# Altium project f1_hw_1.PrjPCB
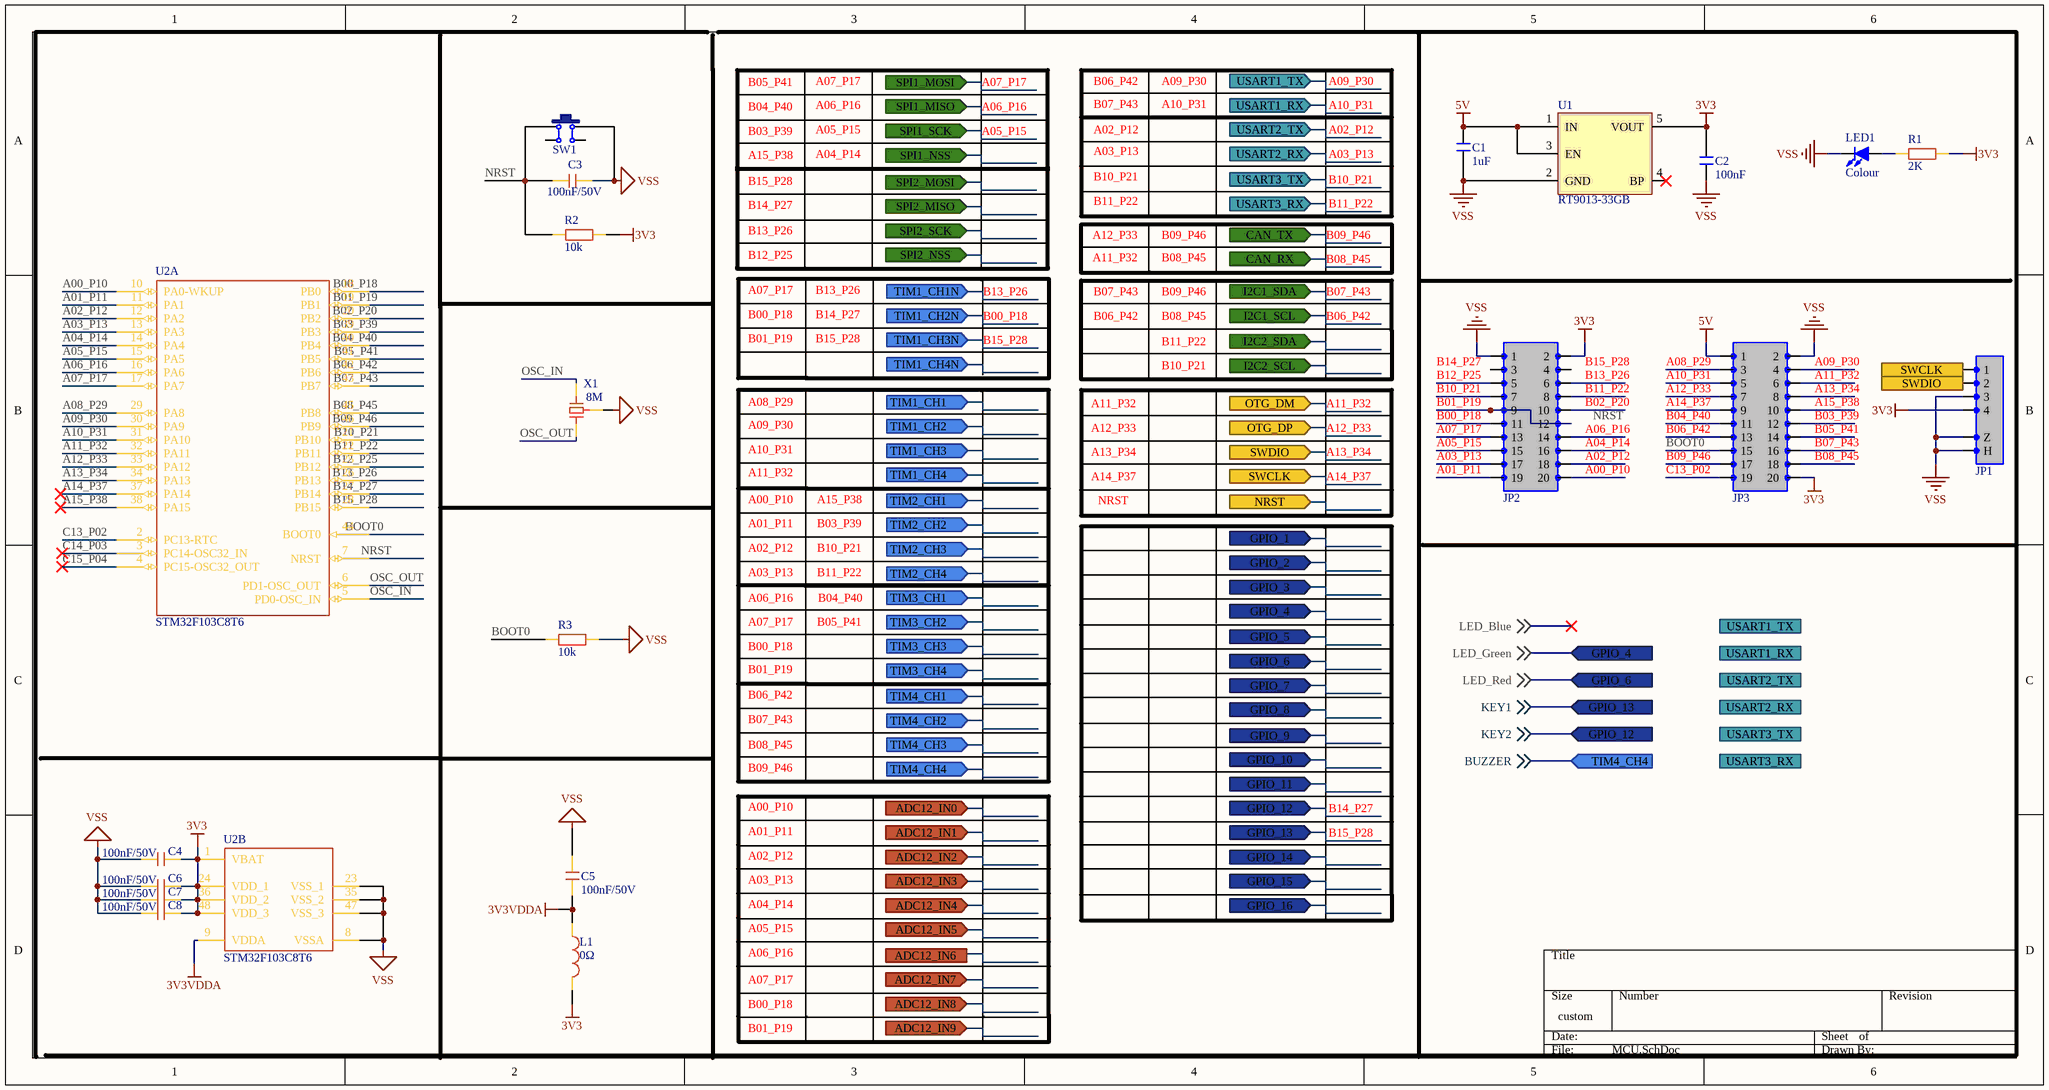
[diagram p0: MCU.SchDoc]
2 sheets, 29 parts. Net scope: flat (ports and power ports of the same name join across sheets).
Board file: f1_hw_1_V00.04.PcbDoc
Sheets:
  MCU.SchDoc
  FUC.SchDoc

## Sheet MCU.SchDoc
size 383 x 203 mm

### Parts
C1  1uF  [C 0603_L]
C2  100nF  [C 0603_L]
C3  100nF/50V  [C 0603_L]
C4  100nF/50V  [C 0603_L]
C5  100nF/50V  [C 0603_L]
C6  100nF/50V  [C 0603_L]
C7  100nF/50V  [C 0603_L]
C8  100nF/50V  [C 0603_L]
JP1  HDR-1X4  [GH 1.25-WS-4P]  (value not drawn)
JP2  Header 2X10  [HDR2.54-LI-2x10P]  (value not drawn)
JP3  Header 2X10  [HDR2.54-LI-2x10P]  (value not drawn)
L1  0Ω  [L 0603]
LED1  Colour  [LED 0603R]
R1  2K  [R 0603_L]
R2  10k  [R 0603_L]
R3  10k  [R 0603_L]
SW1  3.2x4.2x2.5  [TSW SMD-3*4*2]  (value not drawn)
U1  RT9013-33GB  [SOT23-5]
U2  STM32F103C8T6  [LQFP48 7X7_L]  (parts A,B of 2)
X1  8M  [OSC 3213-3P]

### Ports
ADC12_IN0 (in), ADC12_IN1 (in), ADC12_IN2 (in), ADC12_IN3 (in), ADC12_IN4 (in), ADC12_IN5 (in), ADC12_IN6 (in), ADC12_IN7 (in), ADC12_IN8 (in), ADC12_IN9 (in), CAN_RX (in), CAN_TX (in), GPIO_1 (in), GPIO_2 (in), GPIO_3 (in), GPIO_4 (in), GPIO_5 (in), GPIO_6 (in), GPIO_7 (in), GPIO_8 (in), GPIO_9 (in), GPIO_10 (in), GPIO_11 (in), GPIO_12 (in), GPIO_13 (in), GPIO_14 (in), GPIO_15 (in), GPIO_16 (in), I2C1_SCL (in), I2C1_SDA (in), I2C2_SCL (in), I2C2_SDA (in), NRST (in), OTG_DM (in), OTG_DP (in), SPI1_MISO (in), SPI1_MOSI (in), SPI1_NSS (in), SPI1_SCK (in), SPI2_MISO (in), SPI2_MOSI (in), SPI2_NSS (in), SPI2_SCK (in), SWCLK (in), SWDIO (in), TIM1_CH1 (in), TIM1_CH1N (in), TIM1_CH2 (in), TIM1_CH2N (in), TIM1_CH3 (in), TIM1_CH3N (in), TIM1_CH4 (in), TIM1_CH4N (in), TIM2_CH1 (in), TIM2_CH2 (in), TIM2_CH3 (in), TIM2_CH4 (in), TIM3_CH1 (in), TIM3_CH2 (in), TIM3_CH3 (in), TIM3_CH4 (in), TIM4_CH1 (in), TIM4_CH2 (in), TIM4_CH3 (in), TIM4_CH4 (in), USART1_RX (in), USART1_TX (in), USART2_RX (in), USART2_TX (in), USART3_RX (in), USART3_TX (in)

### Nets
3V3: C2.1 C4.2 C6.2 C7.2 C8.2 JP1.4 JP2.2 JP3.20 L1.2 R1.1 R2.2 U1.5(VOUT) U2.1(VBAT) U2.24(VDD_1) U2.36(VDD_2) U2.48(VDD_3)
3V3VDDA: C5.2 L1.1 U2.9(VDDA)
5V: C1.1 JP3.1 U1.1(IN) U1.3(EN)
VSS: C1.2 C2.2 C3.2 C4.1 C5.1 C6.1 C7.1 C8.1 JP1.0(Z) JP1.3 JP1.100(H) JP2.1 JP3.2 LED1.2(K) R3.2 SW1.1 U1.2(GND) U2.8(VSSA) U2.23(VSS_1) U2.35(VSS_2) U2.47(VSS_3) X1.3
A00_P10: JP2.20 U2.10(PA0-WKUP)
A01_P11: JP2.19 U2.11(PA1)
A02_P12: JP2.18 U2.12(PA2) ; port USART2_TX
A03_P13: JP2.17 U2.13(PA3) ; port USART2_RX
A04_P14: JP2.16 U2.14(PA4)
A05_P15: JP2.15 U2.15(PA5) ; port SPI1_SCK
A06_P16: JP2.14 U2.16(PA6) ; port SPI1_MISO
A07_P17: JP2.13 U2.17(PA7) ; port SPI1_MOSI
A08_P29: JP3.3 U2.29(PA8)
A09_P30: JP3.4 U2.30(PA9) ; port USART1_TX
A10_P31: JP3.5 U2.31(PA10) ; port USART1_RX
A11_P32: JP3.6 U2.32(PA11) ; port OTG_DM
A12_P33: JP3.7 U2.33(PA12) ; port OTG_DP
A13_P34: JP1.2 JP3.8 U2.34(PA13) ; port SWDIO
A14_P37: JP1.1 JP3.9 U2.37(PA14) ; port SWCLK
A15_P38: JP3.10 U2.38(PA15)
B00_P18: JP2.11 U2.18(PB0) ; port TIM1_CH2N
B01_P19: JP2.9 JP2.12 U2.19(PB1)
B02_P20: JP2.10 U2.20(PB2)
B03_P39: JP3.12 U2.39(PB3)
B04_P40: JP3.11 U2.40(PB4)
B05_P41: JP3.14 U2.41(PB5)
B06_P42: JP3.13 U2.42(PB6) ; port I2C1_SCL
B07_P43: JP3.16 U2.43(PB7) ; port I2C1_SDA
B08_P45: JP3.18 U2.45(PB8) ; port CAN_RX
B09_P46: JP3.17 U2.46(PB9) ; port CAN_TX
B10_P21: JP2.7 U2.21(PB10) ; port USART3_TX
B11_P22: JP2.8 U2.22(PB11) ; port USART3_RX
B12_P25: JP2.5 U2.25(PB12)
B13_P26: JP2.6 U2.26(PB13) ; port TIM1_CH1N
B14_P27: U2.27(PB14) ; off-sheet KEY2, port GPIO_12  [also labelled KEY2]
B15_P28: U2.28(PB15) ; off-sheet KEY1, port GPIO_13, port TIM1_CH3N  [also labelled KEY1]
BOOT0: JP3.15 R3.1 U2.44(BOOT0)
BUZZER: off-sheet BUZZER, port TIM4_CH4
C13_P02: JP3.19 U2.2(PC13-RTC)
C14_P03: U2.3(PC14-OSC32_IN)
C15_P04: U2.4(PC15-OSC32_OUT)
LED_Green: off-sheet LED_Green, port GPIO_4
LED_Red: off-sheet LED_Red, port GPIO_6
NRST: C3.1 R2.1 SW1.2 U2.7(NRST)
OSC_IN: U2.5(PD0-OSC_IN) X1.2
OSC_OUT: U2.6(PD1-OSC_OUT) X1.1
NetLED1_1: LED1.1(A) R1.2

Not connected (* = marked no-connect by the designer): JP2 3 4; SW1 3 4; U1 4(BP)*

### Notes on the sheet
- Labels drawn without touching a wire or pin: A00_P10, A01_P11, A02_P12, A03_P13, A04_P14, A05_P15, A06_P16, A07_P17, A08_P29, A09_P30, A10_P31, A11_P32, A12_P33, A13_P34, A14_P37, A15_P38, B00_P18, B01_P19, B03_P39, B04_P40, B05_P41, B06_P42, B07_P43, B08_P45, B09_P46, B10_P21, B11_P22, B12_P25, B13_P26, B14_P27, B15_P28, NRST

### Library data of the parts
C1 C2 = C: 无极性贴片电容; 版权归属: 源创客; BOM名称: 无极性贴片电容; 学习资源: www.ooocke.com
C3-C8 = 无极贴片电容: 贴片电容
JP1 = Header 4: 4P接插件; 版权归属: 源创客; BOM名称: 4P接插件; 学习资源: www.ooocke.com
JP2 JP3 = Header 10X2: 10*2P接插件; 版权归属: 源创客; BOM名称: 10*2P接插件; 学习资源: www.ooocke.com
L1 = 磁珠: 小功率贴片电感
LED1 = LED-SMD: 贴片LED; 版权归属: 源创客; BOM名称: 贴片LED; 学习资源: www.ooocke.com
R1-R3 = 电阻: 贴片电阻1%精度
SW1 = TSW SMD-3x4_D: 3.2x4.2轻触开关; BOM名称: 3x6轻触开关; 版权归属: 源创客; 学习资源: www.ooocke.com
U1 = RT9193-33GB
U2 = STM32F103C8T6: STM32F103C8T6是一款由意法半导体公司（ST）推出的基于Cortex-M3内核的32位微控制器，硬件采用LQFP48封装，属于ST公司微控制器中的STM32系列。
X1 = XTAL-3P: 3脚内置电容无源晶振

## Sheet FUC.SchDoc
size A4
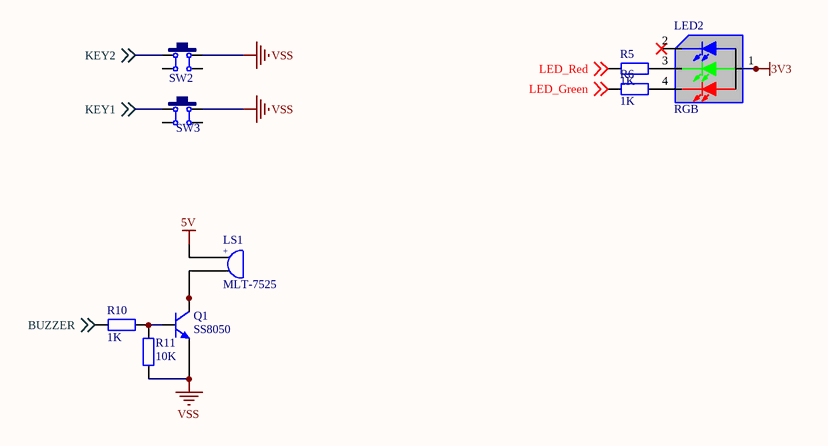
[diagram p1: FUC.SchDoc]

### Parts
LED2  RGB  [LED 3528-RGB]
LS1  MLT-7525  [BUZZER_7525_S]
Q1  SS8050  [SOT23-3L]
R5  1K  [R 0603_L]
R6  1K  [R 0603_L]
R10  1K  [R 0603_L]
R11  10K  [R 0603_L]
SW2  3.2x4.2x2.5  [TSW SMD-3*4*2]  (value not drawn)
SW3  3.2x4.2x2.5  [TSW SMD-3*4*2]  (value not drawn)

### Nets
3V3: LED2.1
5V: LS1.1
VSS: Q1.2(E) R11.2 SW2.1 SW3.1
BUZZER: R10.1 ; off-sheet BUZZER
KEY1: SW3.2 ; off-sheet KEY1  [project net B15_P28]
KEY2: SW2.2 ; off-sheet KEY2  [project net B14_P27]
LED_Green: R6.1 ; off-sheet LED_Green
LED_Red: R5.1 ; off-sheet LED_Red
NetLED2_3: LED2.3 R5.2
NetLED2_4: LED2.4 R6.2
NetLS1_2: LS1.2 Q1.3(C)
NetQ1_1: Q1.1(B) R10.2 R11.1

Not connected (* = marked no-connect by the designer): LED2 2*; SW2 3 4; SW3 3 4

### Notes on the sheet
- (in symbol Buzzer) +

### Library data of the parts
LED2 = LED-RGB-A: 共阳三基色LED; BOM名称: 三基色LED; 版权归属: 源创客; 学习资源: www.ooocke.com
LS1 = Buzzer: 蜂鸣器; 版权归属: 源创客; BOM名称: 蜂鸣器; 学习资源: www.ooocke.com
Q1 = 8050-SMD: 高频放大-NPN型; 版权归属: 源创客; 属性: 40V 1.5A 1W 100MHZ; BOM名称: 高频放大-NPN型; 学习资源: www.ooocke.com
R5 R6 R10 R11 = R: 贴片电阻; 版权归属: 源创客; BOM名称: 贴片电阻; 学习资源: www.ooocke.com
SW2 SW3 = TSW SMD-3x4_D: 3.2x4.2轻触开关; BOM名称: 3x6轻触开关; 版权归属: 源创客; 学习资源: www.ooocke.com

## Nets that join several sheets
3V3: MCU (16 pins), FUC (LED2.1)
5V: MCU (C1.1 JP3.1 U1.1 U1.3), FUC (LS1.1)
VSS: MCU (22 pins), FUC (Q1.2 R11.2 SW2.1 SW3.1)
B14_P27: MCU (U2.27), FUC (SW2.2)
B15_P28: MCU (U2.28), FUC (SW3.2)